# EasyEDA Pro project ProProject_扫描隧道显微镜OpenSTM_2023-08-25.epro, schematic ControlBoard

## Sheets
1 P1: Create Date: 2022-03-07; Page Name: P1; Project Name: STM-New-Structure; Schematic Name: ControlBoard; Update Date: 2022-12-20; Add into BOM: yes; Convert to PCB: yes
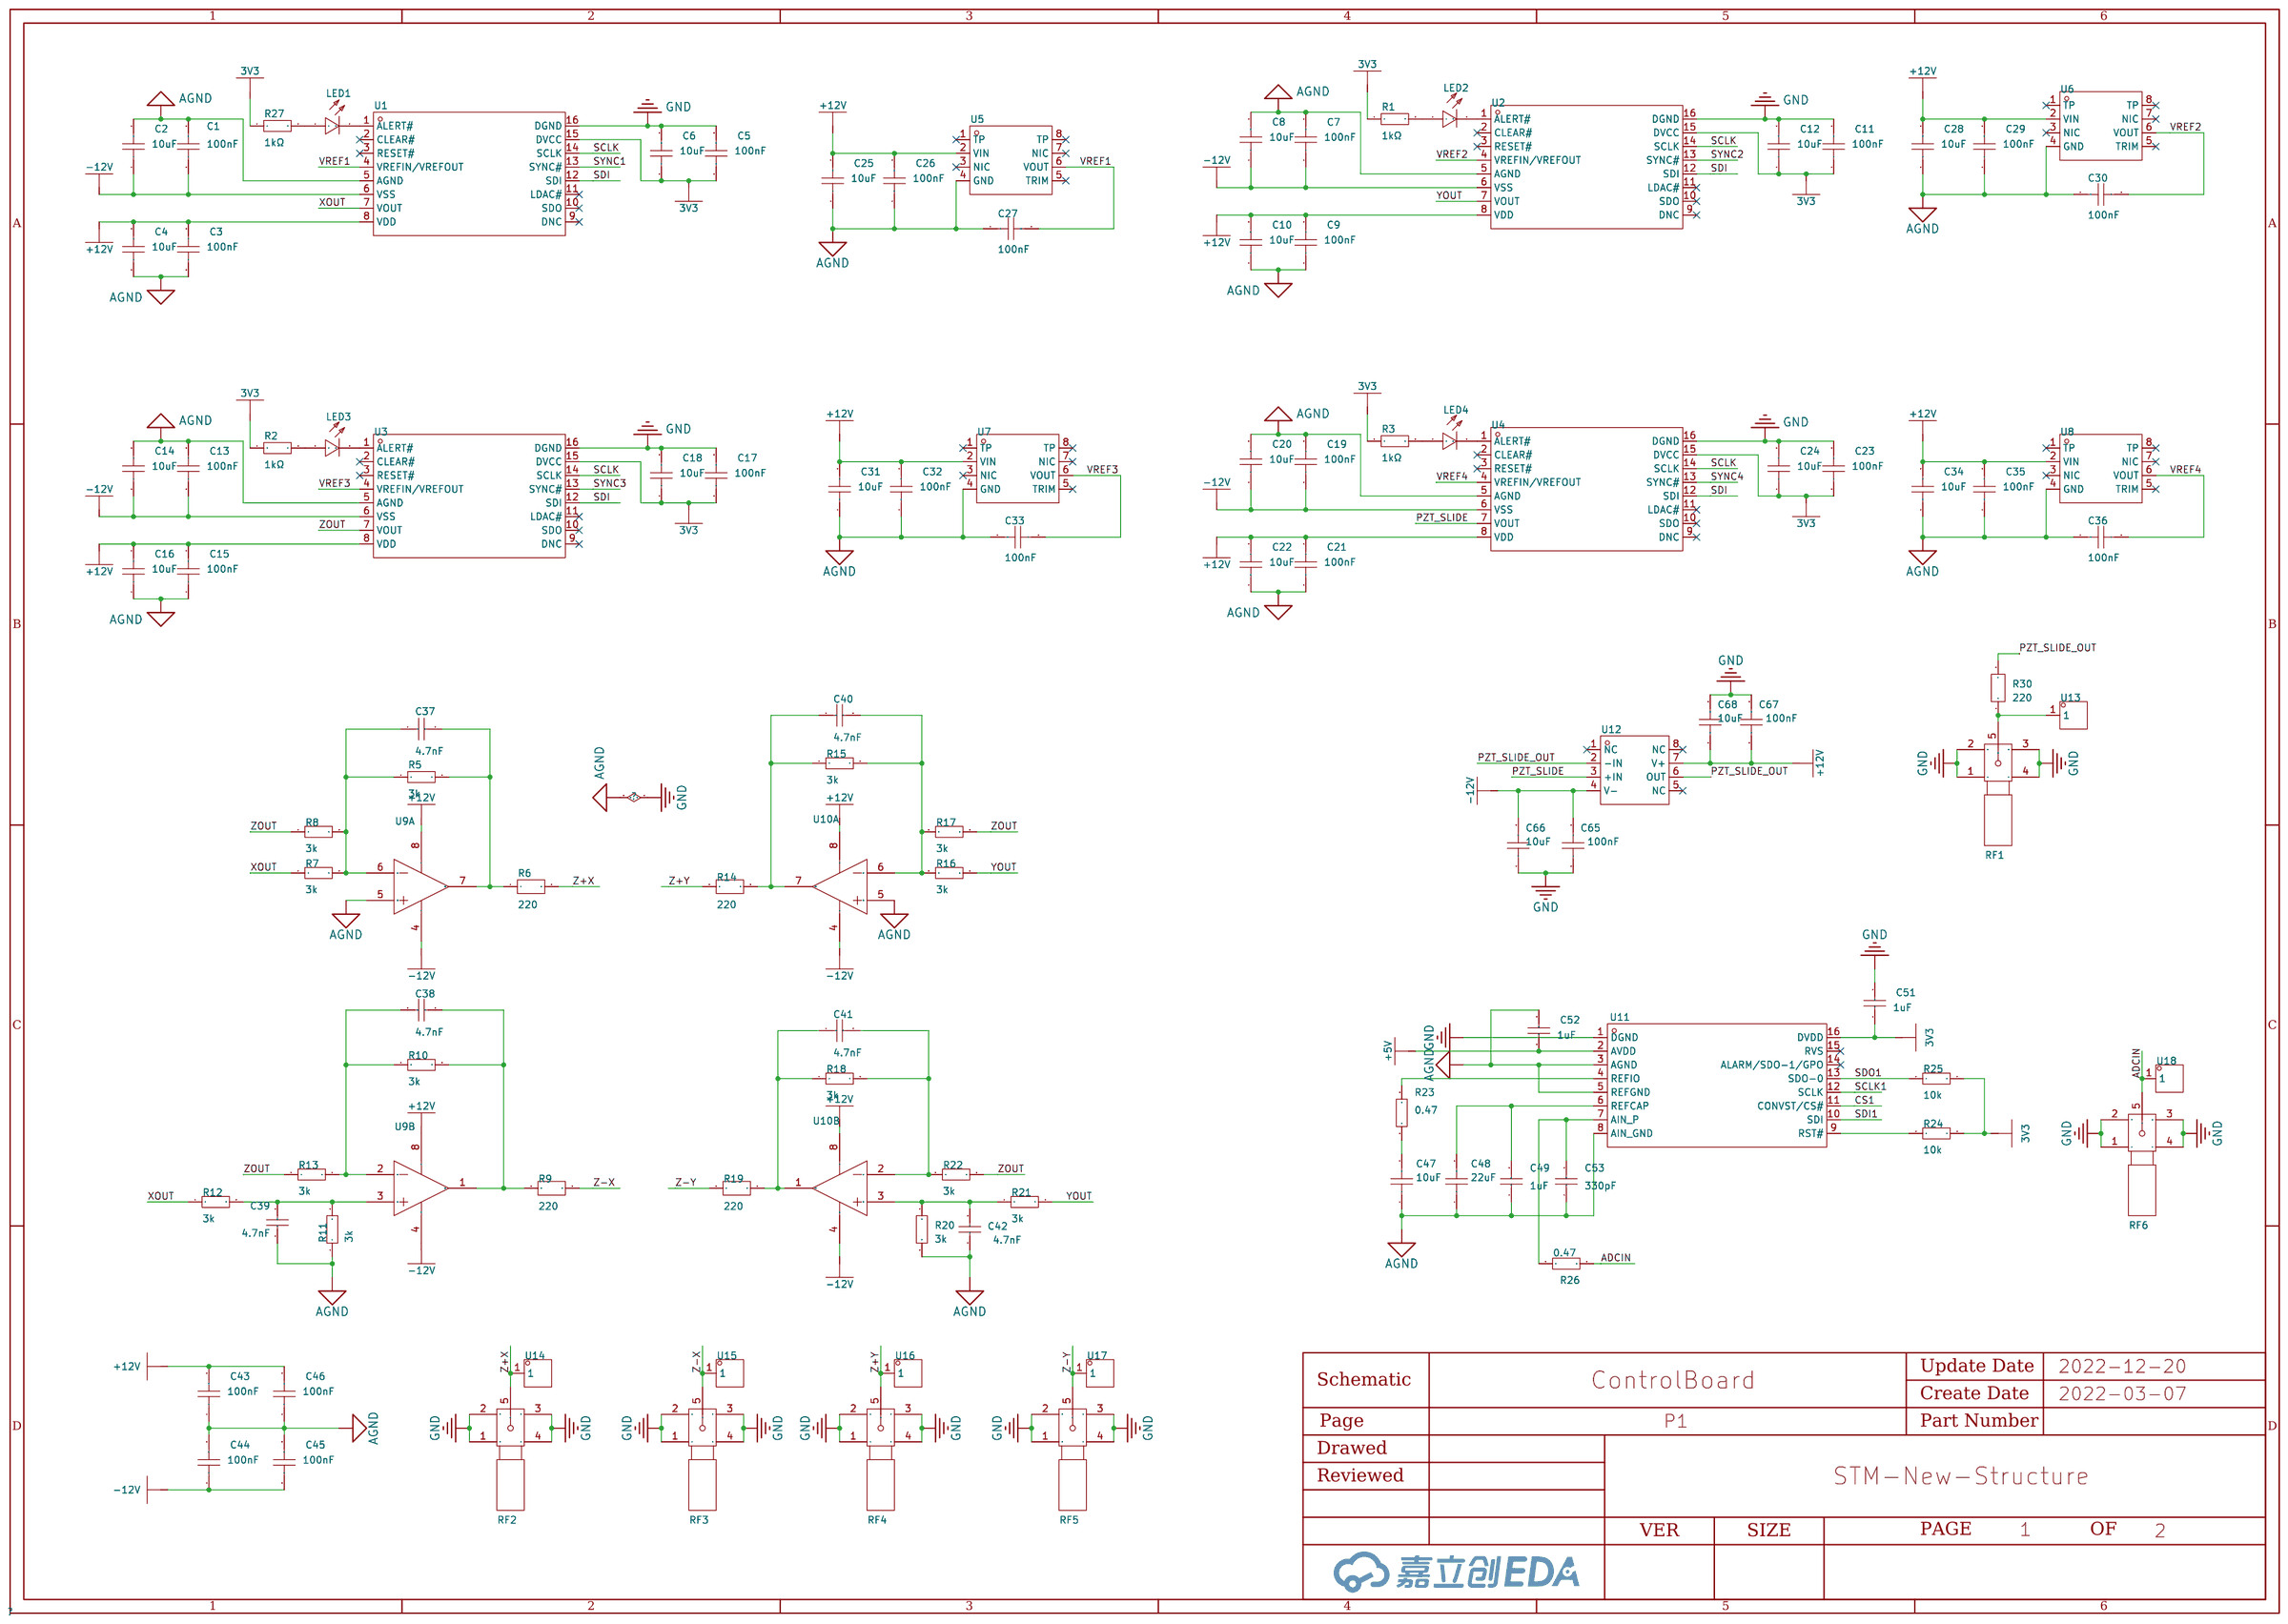
[diagram p0: P1]
2 P2: Create Date: 2022-03-08; Page Name: P2; Update Date: 2023-01-28
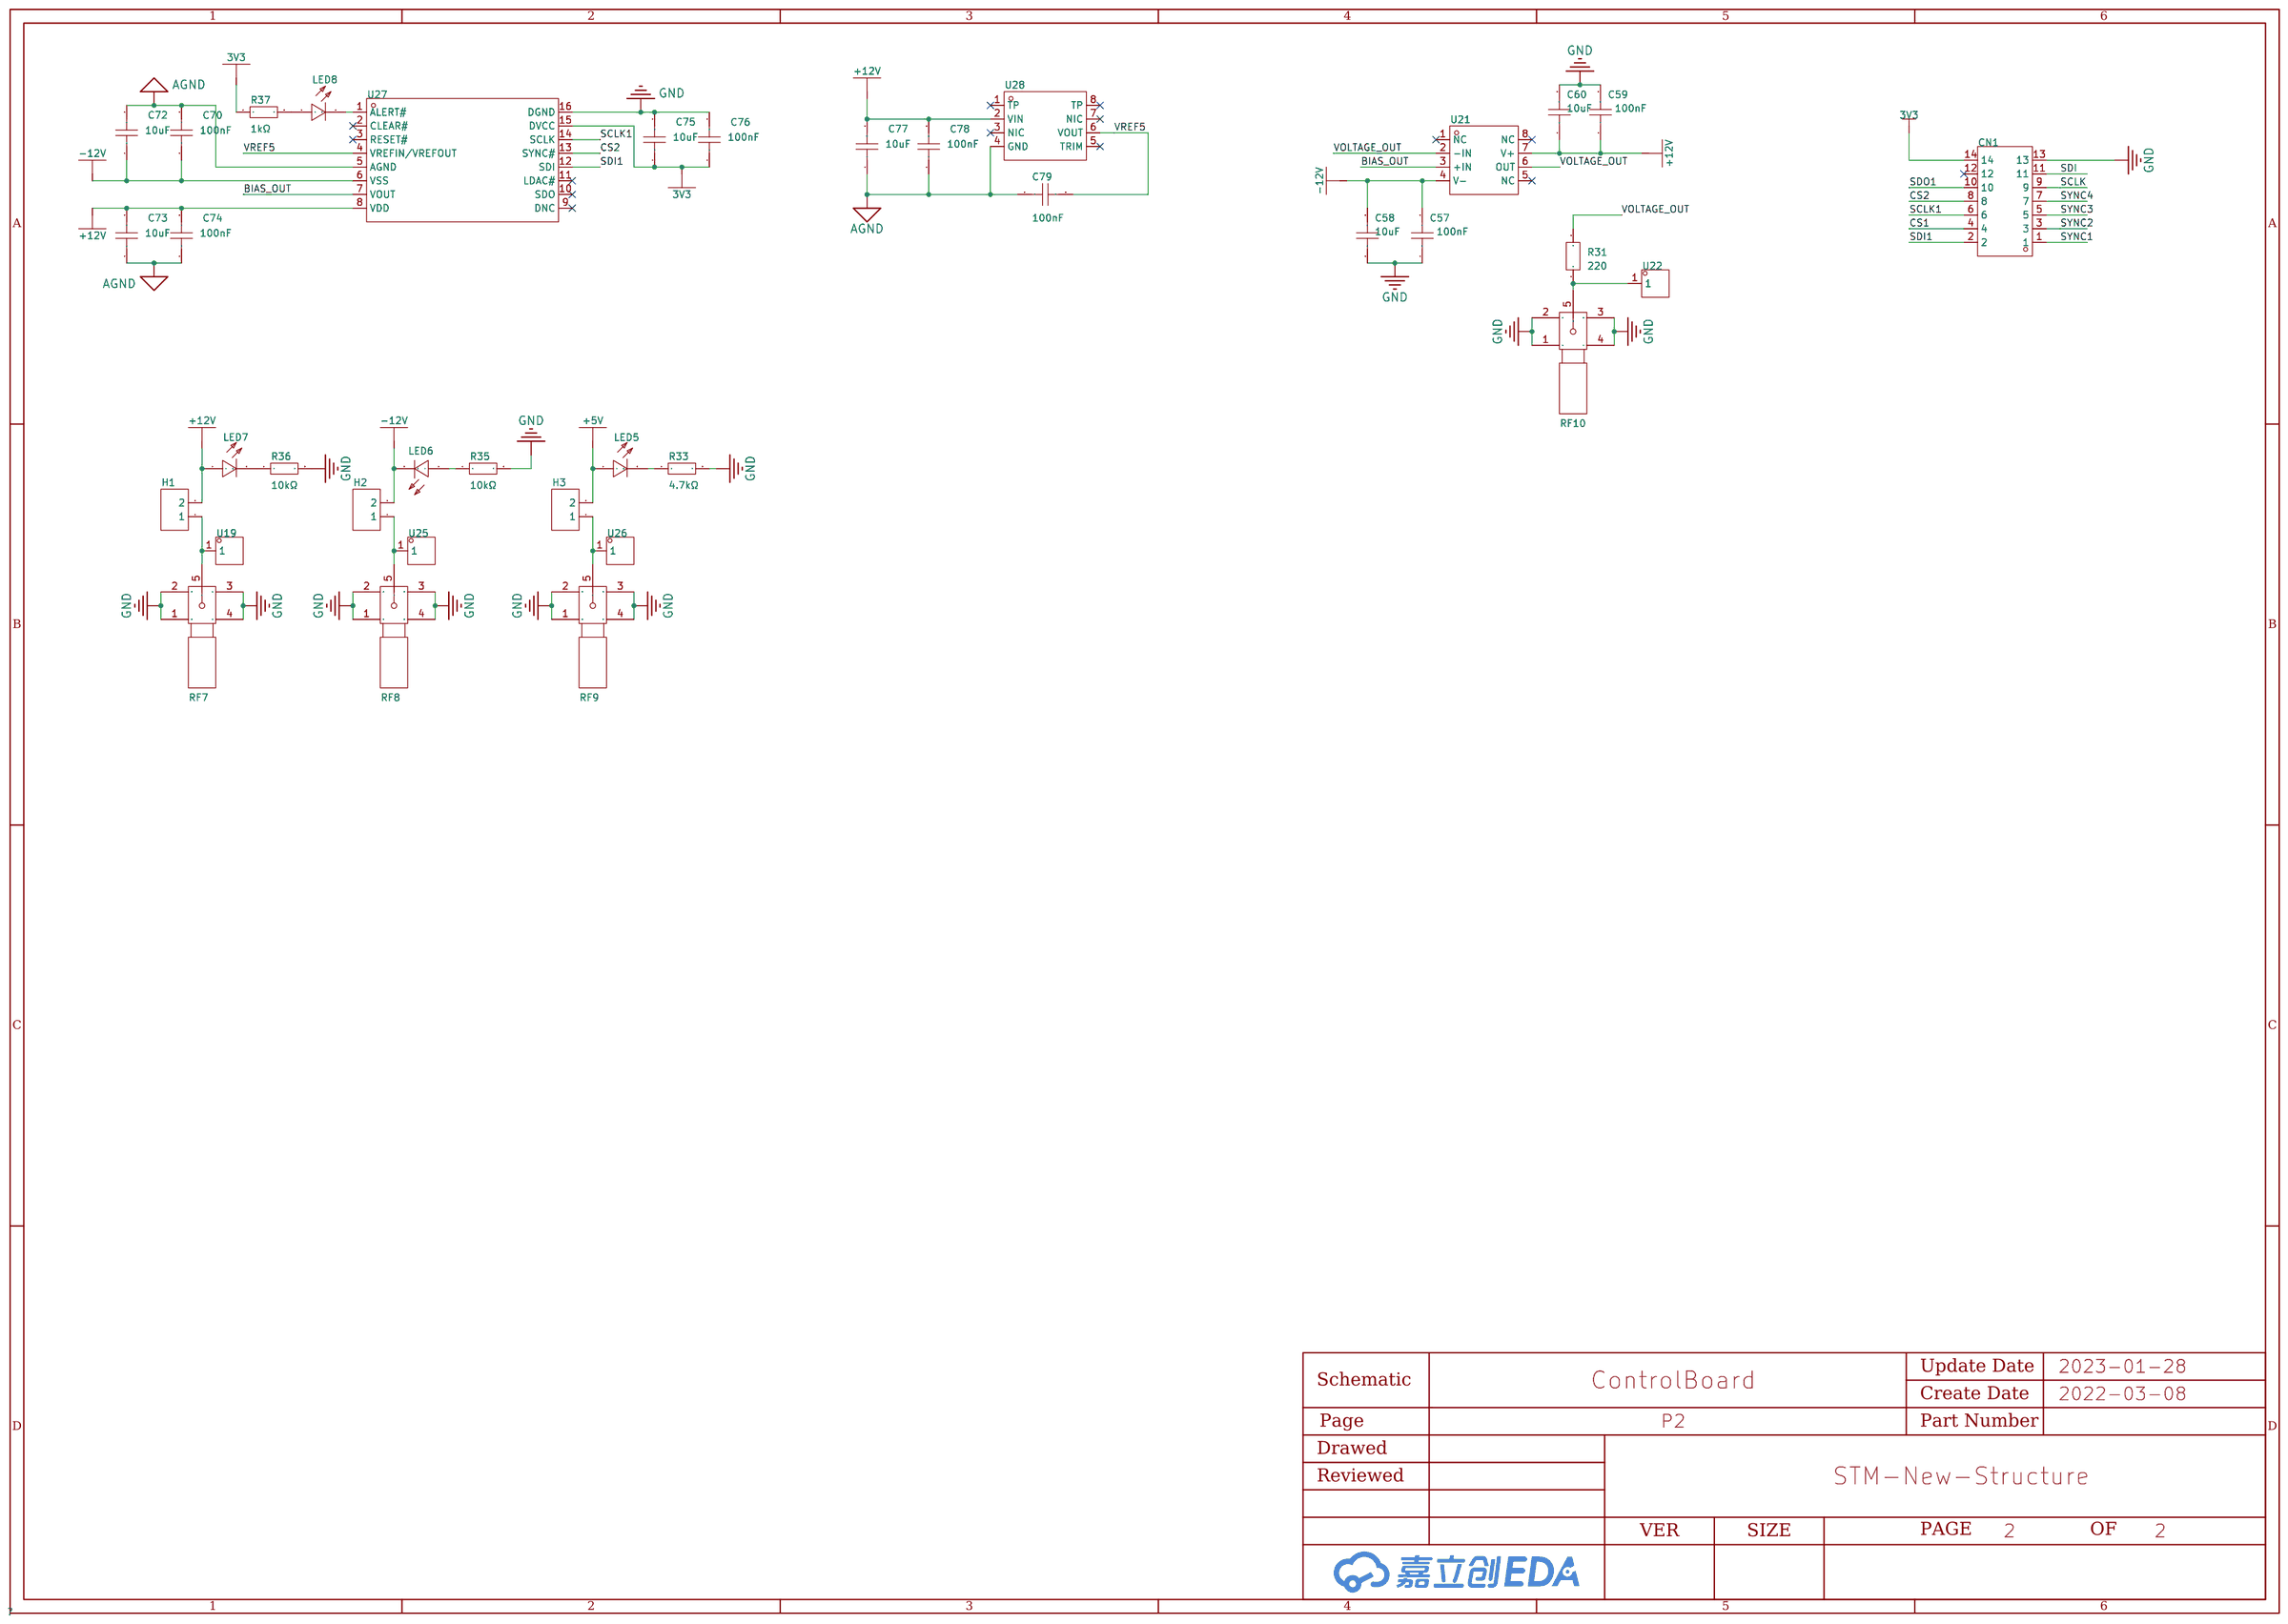
[diagram p1: P2]

## Parts
sheet P1
C1  100nF  [C0603]
C2  10uF  [C0603]
C3  100nF  [C0603]
C4  10uF  [C0603]
C5  100nF  [C0603]
C6  10uF  [C0603]
C7  100nF  [C0603]
C8  10uF  [C0603]
C9  100nF  [C0603]
C10  10uF  [C0603]
C11  100nF  [C0603]
C12  10uF  [C0603]
C13  100nF  [C0603]
C14  10uF  [C0603]
C15  100nF  [C0603]
C16  10uF  [C0603]
C17  100nF  [C0603]
C18  10uF  [C0603]
C19  100nF  [C0603]
C20  10uF  [C0603]
C21  100nF  [C0603]
C22  10uF  [C0603]
C23  100nF  [C0603]
C24  10uF  [C0603]
C25  10uF  [C0603]
C26  100nF  [C0603]
C27  100nF  [C0603]
C28  10uF  [C0603]
C29  100nF  [C0603]
C30  100nF  [C0603]
C31  10uF  [C0603]
C32  100nF  [C0603]
C33  100nF  [C0603]
C34  10uF  [C0603]
C35  100nF  [C0603]
C36  100nF  [C0603]
C37  4.7nF  [C0603]
C38  4.7nF  [C0603]
C39  4.7nF  [C0603]
C40  4.7nF  [C0603]
C41  4.7nF  [C0603]
C42  4.7nF  [C0603]
C43  100nF  [C0603]
C44  100nF  [C0603]
C45  100nF  [C0603]
C46  100nF  [C0603]
C47  10uF  [C0603]
C48  22uF  [C0603]
C49  1uF  [C0603]
C51  1uF  [C0603]
C52  1uF  [C0603]
C53  330pF  [C0603]
C65  100nF  [C0603]
C66  10uF  [C0603]
C67  100nF  [C0603]
C68  10uF  [C0603]
LED1  -  [LED0603-R-RD]
LED2  -  [LED0603-R-RD]
LED3  -  [LED0603-R-RD]
LED4  -  [LED0603-R-RD]
R1  1kΩ  [R0603]
R2  1kΩ  [R0603]
R3  1kΩ  [R0603]
R5  3k  [R0603]
R6  220  [R0603]
R7  3k  [R0603]
R8  3k  [R0603]
R9  220  [R0603]
R10  3k  [R0603]
R11  3k  [R0603]
R12  3k  [R0603]
R13  3k  [R0603]
R14  220  [R0603]
R15  3k  [R0603]
R16  3k  [R0603]
R17  3k  [R0603]
R18  3k  [R0603]
R19  220  [R0603]
R20  3k  [R0603]
R21  3k  [R0603]
R22  3k  [R0603]
R23  0.47  [R0603]
R24  10k  [R0603]
R25  10k  [R0603]
R26  0.47  [R0603]
R27  1kΩ  [R0603]
R30  220  [R0603]
RF1  -  [SMA-TH_KH-SMA-KE-Z]
RF2  -  [SMA-TH_KH-SMA-KE-Z]
RF3  -  [SMA-TH_KH-SMA-KE-Z]
RF4  -  [SMA-TH_KH-SMA-KE-Z]
RF5  -  [SMA-TH_KH-SMA-KE-Z]
RF6  -  [SMA-TH_KH-SMA-KE-Z]
U1  -  [TSSOP-16_L5.0-W4.4-P0.65-LS6.4-TL]
U2  -  [TSSOP-16_L5.0-W4.4-P0.65-LS6.4-TL]
U3  -  [TSSOP-16_L5.0-W4.4-P0.65-LS6.4-TL]
U4  -  [TSSOP-16_L5.0-W4.4-P0.65-LS6.4-TL]
U5  -  [SOIC-8_L4.9-W3.9-P1.27-LS6.0-BL]
U6  -  [SOIC-8_L4.9-W3.9-P1.27-LS6.0-BL]
U7  -  [SOIC-8_L4.9-W3.9-P1.27-LS6.0-BL]
U8  -  [SOIC-8_L4.9-W3.9-P1.27-LS6.0-BL]
U9  -  [SOIC-8_L4.9-W3.9-P1.27-LS6.0-BL]  (sections 1,2)
U10  -  [SOIC-8_L4.9-W3.9-P1.27-LS6.0-BL]  (sections 1,2)
U11  -  [TSSOP-16_L5.0-W4.4-P0.65-LS6.4-TL]
U12  -  [SOIC-8_L4.9-W3.9-P1.27-LS6.0-BL]
U13  -  [TEST-SMD_L2.7-W1.0]
U14  -  [TEST-SMD_L2.7-W1.0]
U15  -  [TEST-SMD_L2.7-W1.0]
U16  -  [TEST-SMD_L2.7-W1.0]
U17  -  [TEST-SMD_L2.7-W1.0]
U18  -  [TEST-SMD_L2.7-W1.0]
sheet P2
C57  100nF  [C0603]
C58  10uF  [C0603]
C59  100nF  [C0603]
C60  10uF  [C0603]
C70  100nF  [C0603]
C72  10uF  [C0603]
C73  10uF  [C0603]
C74  100nF  [C0603]
C75  10uF  [C0603]
C76  100nF  [C0603]
C77  10uF  [C0603]
C78  100nF  [C0603]
C79  100nF  [C0603]
CN1  X9555WR-2x07-6TV01  [CONN-TH_14P-P2.54_XKB_X9555WR-2X7-6TV01]
H1  -  [HDR-TH_2P-P2.54-V-F]
H2  -  [HDR-TH_2P-P2.54-V-F]
H3  -  [HDR-TH_2P-P2.54-V-F]
LED5  -  [LED0603-R-RD]
LED6  -  [LED0603-R-RD]
LED7  -  [LED0603-R-RD]
LED8  -  [LED0603-R-RD]
R31  220  [R0603]
R33  4.7kΩ  [R0603]
R35  10kΩ  [R0603]
R36  10kΩ  [R0603]
R37  1kΩ  [R0603]
RF7  -  [SMA-TH_KH-SMA-KE-Z]
RF8  -  [SMA-TH_KH-SMA-KE-Z]
RF9  -  [SMA-TH_KH-SMA-KE-Z]
RF10  -  [SMA-TH_KH-SMA-KE-Z]
U19  -  [TEST-SMD_L2.7-W1.0]
U21  AD8671ARZ-REEL7  [SOIC-8_L4.9-W3.9-P1.27-LS6.0-BL]
U22  -  [TEST-SMD_L2.7-W1.0]
U25  -  [TEST-SMD_L2.7-W1.0]
U26  -  [TEST-SMD_L2.7-W1.0]
U27  AD5721RBRUZ-RL7  [TSSOP-16_L5.0-W4.4-P0.65-LS6.4-BL]
U28  -  [SOIC-8_L4.9-W3.9-P1.27-LS6.0-BL]

## Library data of the parts
C1 C3 C5 C7 C9 C11 C13 C15 C17 C19 C21 C23 C26 C27 C29 C30 C32 C33 C35 C36 C43-C46 C57 C59 C65 C67 C70 C74 C76 C78 C79 = CL10B104KA8NNNC: 容值:100nF;精度:±10%;额定电压:25V;温度系数:X7R;; LCSC Part Name: 100nF ±10% 25V; Supplier Part: C1590; Manufacturer: SAMSUNG(三星); Supplier Footprint: 0603; JLCPCB Part Class: Extended Part; Datasheet: https://atta.szlcsc.com/upload/public/pdf/source/20160103/1457707680294.pdf; Supplier: LCSC; Tolerance: ±10%; Voltage Rated: 25V; Temperature Coefficient: X7R
C2 C4 C6 C8 C10 C12 C14 C16 C18 C20 C22 C24 C25 C28 C31 C34 C47 C58 C60 C66 C68 C72 C73 C75 C77 = GRM188R61E106MA73D: 容值:10uF;精度:±20%;额定电压:25V;温度系数:X5R;; LCSC Part Name: 10uF ±20% 25V; Supplier Part: C91606; Manufacturer: muRata(村田); Supplier Footprint: 0603; JLCPCB Part Class: Extended Part; Datasheet: https://atta.szlcsc.com/upload/public/pdf/source/20161226/1482720176185.pdf; Supplier: LCSC; Tolerance: ±20%; Voltage Rated: 25V; Temperature Coefficient: X5R
C37-C42 = 0603B472K500NT: 容值:4.7nF;精度:±10%;额定电压:50V;温度系数:X7R;; LCSC Part Name: 4.7nF ±10% 50V; Supplier Part: C53987; Manufacturer: FH(风华); Supplier Footprint: 0603; JLCPCB Part Class: Basic Part; Datasheet: https://atta.szlcsc.com/upload/public/pdf/source/20170923/C53987_1506149489951988835.pdf; Supplier: LCSC; Tolerance: ±10%; Voltage Rated: 50V; Temperature Coefficient: X7R
C48 = CL10A226MP8NUNE: 容值:22uF;精度:±20%;额定电压:10V;温度系数:X5R;; LCSC Part Name: 22uF ±20% 10V; Supplier Part: C86295; Manufacturer: SAMSUNG(三星); Supplier Footprint: 0603; JLCPCB Part Class: Extended Part; Datasheet: https://atta.szlcsc.com/upload/public/pdf/source/20170325/1490427882169.pdf; Supplier: LCSC; Tolerance: ±20%; Voltage Rated: 10V; Temperature Coefficient: X5R
C49 C51 C52 = CL10A105KA8NNNC: 容值:1uF;精度:±10%;额定电压:25V;温度系数:X5R;; LCSC Part Name: 1uF ±10% 25V; Supplier Part: C5673; Manufacturer: SAMSUNG(三星); Supplier Footprint: 0603; JLCPCB Part Class: Extended Part; Datasheet: https://atta.szlcsc.com/upload/public/pdf/source/20160103/1457707739994.pdf; Supplier: LCSC; Tolerance: ±10%; Voltage Rated: 25V; Temperature Coefficient: X5R
C53 = CL10C331JB8NNNC: 容值:330pF;精度:±5%;额定电压:50V;温度系数:C0G;; LCSC Part Name: 330pF ±5% 50V; Supplier Part: C1664; Manufacturer: SAMSUNG(三星); Supplier Footprint: 0603; JLCPCB Part Class: Basic Part; Datasheet: https://atta.szlcsc.com/upload/public/pdf/source/20160103/1457707688612.pdf; Supplier: LCSC; Tolerance: ±5%; Voltage Rated: 50V; Temperature Coefficient: C0G
LED1-LED8 = 19-217/R6C-AL1M2VY/3T: 发光颜色:红灯;二极管配置:-;透镜颜色:无色透明;主波长:617.5nm;峰值波长:632nm;色温:-;光通量(25时):-;测试电流:5mA;正向电压(VF):2.2V;发光强度:28.5mcd;功率:60mW;发光角度:120°;安装方式:-;工作温度:-40~+85;; LCSC Part Name: 0603 红灯; Supplier Part: C72044; Manufacturer: EVERLIGHT(台湾亿光); Supplier Footprint: 0603; JLCPCB Part Class: Extended Part; Datasheet: https://atta.szlcsc.com/upload/public/pdf/source/20160507/1462613613821.pdf; Supplier: LCSC; Emitted Color: 红灯; Lens Color: 无色透明; Dominant Wavelength: 617.5nm; Peak Wavelength: 632nm; Forward Current: 5mA; Forward Voltage (VF): 2.2V; Luminous Intensity: 28.5mcd; Power Dissipation: 60mW; Viewing Angle: 120°; Operating Temperature: -40~+85
R1-R3 R27 R37 = 0603WAF1001T5E: 电阻类型:厚膜电阻;阻值:1kΩ;精度:±1%;功率:100mW;温度系数:±100ppm/℃;最大工作电压:75V;工作温度范围:-55℃~+155℃;; LCSC Part Name: 1kΩ±1%100mW; Supplier Part: C21190; Manufacturer: UNI-ROYAL(厚声); Supplier Footprint: 0603; JLCPCB Part Class: BasicPart; Datasheet: https://atta.szlcsc.com/upload/public/pdf/source/20200306/C422600_1E6D84923E4A46A82E41ADD87F860B5C.pdf; Supplier: LCSC; Type: 厚膜电阻; Tolerance: ±1%; Power(Watts): 100mW; Temperature Coefficient: ±100ppm/℃; Overload Voltage (Max): 75V; Operating Temperature Range: -55℃~+155℃
R5 R7 R8 R10-R13 R15-R18 R20-R22 = ARG03DTC3001: 电阻类型:薄膜电阻;阻值:3k;精度:±0.5%;功率:100mW;温度系数:±25ppm/;最大工作电压:75V;工作温度范围:-55~+155;; LCSC Part Name: 3k ±0.5% 100mW; Supplier Part: C311916; Manufacturer: 光颉(Viking); Supplier Footprint: 0603; JLCPCB Part Class: Extended Part; Datasheet: https://atta.szlcsc.com/upload/public/pdf/source/20181119/C311916_083AB72433BF5B624DBE6C035DD51480.pdf; Supplier: LCSC; Type: 薄膜电阻; Tolerance: ±0.5%; Power(Watts): 100mW; Temperature Coefficient: ±25ppm/; Overload Voltage (Max): 75V; Operating Temperature Range: -55~+155
R6 R9 R14 R19 R30 R31 = ERJU3RD2200V: 阻值:220;精度:±0.5%;功率:100mW;温度系数:±50ppm/;最大工作电压:-;工作温度范围:-55~+155;; LCSC Part Name: 220 ±0.5% 100mW; Supplier Part: C491169; Manufacturer: PANASONIC(松下); Supplier Footprint: 0603; JLCPCB Part Class: Extended Part; Datasheet: https://atta.szlcsc.com/upload/public/pdf/source/20200407/C491169_AC2E94AF70820CF85EC0143B46F9F0DA.pdf; Supplier: LCSC; Tolerance: ±0.5%; Power(Watts): 100mW; Temperature Coefficient: ±50ppm/; Operating Temperature Range: -55~+155
R23 R26 = RL0603FR-070R47L: 阻值:0.47;精度:±1%;功率:100mW;温度系数:±800ppm/;; LCSC Part Name: 0.47 ±1% 100mW; Supplier Part: C326953; Manufacturer: YAGEO(国巨); Supplier Footprint: 0603; JLCPCB Part Class: Extended Part; Datasheet: https://atta.szlcsc.com/upload/public/pdf/source/20181031/C326953_2A06D5EACD581F8EE6DB7FFE6C5B8872.pdf; Supplier: LCSC; Tolerance: ±1%; Power(Watts): 100mW; Temperature Coefficient: ±800ppm/
R24 R25 = 0603WAF1002T5E: 电阻类型:厚膜电阻;阻值:10k;精度:±1%;功率:1/10W;温度系数:±100ppm/;最大工作电压:75V;工作温度范围:-55~+155;; LCSC Part Name: 10k ±1%; Supplier Part: C25804; Manufacturer: UNI-ROYAL(厚声); Supplier Footprint: 0603; JLCPCB Part Class: Basic Part; Datasheet: https://atta.szlcsc.com/upload/public/pdf/source/20200306/C422600_1E6D84923E4A46A82E41ADD87F860B5C.pdf; Supplier: LCSC; Type: 厚膜电阻; Tolerance: ±1%; Power(Watts): 1/10W; Temperature Coefficient: ±100ppm/; Overload Voltage (Max): 75V; Operating Temperature Range: -55~+155
RF1-RF10 = KH-SMA-KE-Z: 连接器类型:板端;射频系列:SMA;接口类型:内孔;端口数量:1;阻抗:-;频率-最大值:-;样式:正脚;接口直径:6.2mm;接口长度/高度:8mm;工作温度范围:-;; LCSC Part Name: SMA内孔正脚镀金半牙H=8MM; Supplier Part: C504007; Manufacturer: kinghelm(金航标); Supplier Footprint: 插件; JLCPCB Part Class: ExtendedPart; Datasheet: https://atta.szlcsc.com/upload/public/pdf/source/20200330/C504007_C31FA59B5EDC95FA4ACB3324B1A20151.pdf; Supplier: LCSC; Connector Type: 板端; RF Series: SMA; Interface Type: 内孔; Number of Ports: 1; Style: 正脚; Interface Diameter: 6.2mm; Interface Length/Height: 8mm
U1-U4 = AD5761RBRUZ: D/A 位数:-;D/A通道数:-;输出类型:-;读写接口类型:-;; Supplier Part: C404015; Manufacturer: ADI(亚德诺)/LINEAR; Supplier Footprint: TSSOP-16; JLCPCB Part Class: Extended Part; Datasheet: https://atta.szlcsc.com/upload/public/pdf/source/20190722/C404015_21C88E48C88813C7B0010A18F7ED8816.pdf; Supplier: LCSC
U5-U8 U28 = ADR421BRZ-REEL: Supplier Part: C496503; Manufacturer: ADI(亚德诺)/LINEAR; Supplier Footprint: SOIC-8; JLCPCB Part Class: Extended Part; Datasheet: https://atta.szlcsc.com/upload/public/pdf/source/20200316/C496503_A1F080746FA87D9455D96FF2B5AA62EC.pdf; Supplier: LCSC
U9 U10 = OPA2227UA/2K5: 运放类型:General Purpose;放大器组数:2;增益带宽积（GBP）:8MHz;压摆率（SR）:2.3 V/us;电源电压:5V ~ 36V, ±2.5V ~ 18V;各通道供电电流:3.7mA;; Supplier Part: C19308; Manufacturer: TI(德州仪器); Supplier Footprint: SOIC-8_150mil; JLCPCB Part Class: Extended Part; Datasheet: https://atta.szlcsc.com/upload/public/pdf/source/20130925/1457706650838.pdf; Supplier: LCSC; Amplifier Type: General Purpose; Number of Circuits: 2; Gain Bandwidth Product（GBP）: 8MHz; Slew Rate（SR）: 2.3 V/us; Supply Voltage（Single）: 5V ~ 36V, ±2.5V ~ 18V; Iq per channel (Typ): 3.7mA
U11 = ADS8685IPWR: A/D 位数:-;采样率（sps）:-;输入数:-;输入类型:-;; Supplier Part: C2669941; Manufacturer: TI(德州仪器); Supplier Footprint: TSSOP-16; JLCPCB Part Class: Extended Part; Supplier: LCSC
U12 U21 = AD8671ARZ-REEL7: 运放类型:GeneralPurpose;放大器组数:1;增益带宽积（GBP）:10MHz;压摆率（SR）:4V/us;电源电压:10V~36V,±5V~18V;各通道供电电流:3mA;; Supplier Part: C56309; Manufacturer: ADI(亚德诺)/LINEAR; Supplier Footprint: SOIC-8_150mil; JLCPCB Part Class: ExtendedPart; Datasheet: https://atta.szlcsc.com/upload/public/pdf/source/20150821/1457707348731.pdf; Supplier: LCSC; Amplifier Type: GeneralPurpose; Number of Circuits: 1; Gain Bandwidth Product（GBP）: 10MHz; Slew Rate（SR）: 4V/us; Supply Voltage（Single）: 10V~36V,±5V~18V; Iq per channel (Typ): 3mA; Operating Temperature: -40°C~125°C
U13-U19 U22 U25 U26 = 5017: 连接器类型:测试点/测试环;颜色:-;; LCSC Part Name: 测试点/测试环; Supplier Part: C238130; Manufacturer: Keystone; JLCPCB Part Class: ExtendedPart; Datasheet: https://atta.szlcsc.com/upload/public/pdf/source/20180629/C238130_5A26801579F58754781F264880A43AC8.PDF; Supplier: LCSC; Connector Type: 测试点/测试环
CN1 = X9555WR-2x07-6TV01: 参考系列:-;间距:2.54mm;插针结构:2x7P;排数:2;每排PIN数:7;行距:2.54mm;公母:公型插针;安装方式:弯插;额定电流:3A;触头材质:黄铜;触头镀层:金;工作温度范围:-25℃~+85℃;焊接温度(最大值):260℃;; LCSC Part Name: 2.54mm2x7P弯插; Supplier Part: C2884505; Manufacturer: XKBConnectivity(中国星坤); Supplier Footprint: 弯插,P=2.54mm; JLCPCB Part Class: ExtendedPart; Datasheet: https://atta.szlcsc.com/upload/public/pdf/source/20211009/ED69AC5D0B165AFEE3838F4DF324EF6E.pdf; Supplier: LCSC; Pitch: 2.54mm; Pins Structure: 2x7P; Number of Rows: 2; Number of PINs Per Row: 7; Row Spacing: 2.54mm; Gender: 公型插针; Mounting Style: 弯插; Current Rating (Max): 3A; Contact Material: 黄铜; Contact Plating: 金; Operating Temperature Range: -25℃~+85℃; Welding Temperature (Max): 260℃
H1-H3 = HDR-F_2.54_1x2P: Supplier Part: C49661; Supplier Footprint: 插件
R33 = 0603WAF4701T5E: 电阻类型:厚膜电阻;阻值:4.7kΩ;精度:±1%;功率:100mW;温度系数:±100ppm/℃;最大工作电压:75V;工作温度范围:-55℃~+155℃;; LCSC Part Name: 4.7kΩ±1%100mW; Supplier Part: C23162; Manufacturer: UNI-ROYAL(厚声); Supplier Footprint: 0603; JLCPCB Part Class: BasicPart; Datasheet: https://atta.szlcsc.com/upload/public/pdf/source/20200306/C422600_1E6D84923E4A46A82E41ADD87F860B5C.pdf; Supplier: LCSC; Type: 厚膜电阻; Tolerance: ±1%; Power(Watts): 100mW; Temperature Coefficient: ±100ppm/℃; Overload Voltage (Max): 75V; Operating Temperature Range: -55℃~+155℃
R35 R36 = 0603WAF1002T5E: 电阻类型:厚膜电阻;阻值:10kΩ;精度:±1%;功率:100mW;温度系数:±100ppm/℃;最大工作电压:75V;工作温度范围:-55℃~+155℃;; LCSC Part Name: 10kΩ±1%100mW; Supplier Part: C25804; Manufacturer: UNI-ROYAL(厚声); Supplier Footprint: 0603; JLCPCB Part Class: BasicPart; Datasheet: https://atta.szlcsc.com/upload/public/pdf/source/20200306/C422600_1E6D84923E4A46A82E41ADD87F860B5C.pdf; Supplier: LCSC; Type: 厚膜电阻; Tolerance: ±1%; Power(Watts): 100mW; Temperature Coefficient: ±100ppm/℃; Overload Voltage (Max): 75V; Operating Temperature Range: -55℃~+155℃
U27 = AD5721RBRUZ-RL7: Supplier Part: C2679721; Manufacturer: ADI(亚德诺)/LINEAR(凌特); Supplier Footprint: TSSOP-16; JLCPCB Part Class: ExtendedPart; Datasheet: https://atta.szlcsc.com/upload/public/pdf/source/20210603/ECE7F6A4264BD924F9063B284D4D4E62.pdf; Supplier: LCSC

## Nets
3V3: C5.1 C6.1 C11.1 C12.1 C17.1 C18.1 C23.1 C24.1 C51.1 C75.1 C76.1 CN1.14 R1.1 R2.1 R3.1 R24.2 R25.2 R27.1 R37.1 U1.15(DVCC) U2.15(DVCC) U3.15(DVCC) U4.15(DVCC) U11.16(DVDD) U27.15(DVCC)
+5V: C52.1 H3.2 LED5.1(A) U11.2(AVDD)
+12V: C3.2 C4.2 C9.2 C10.2 C15.2 C16.2 C21.2 C22.2 C25.2 C26.2 C28.2 C29.2 C31.2 C32.2 C34.2 C35.2 C43.2 C46.2 C59.1 C60.1 C67.1 C68.1 C73.2 C74.2 C77.2 C78.2 H1.2 LED7.1(A) U1.8(VDD) U2.8(VDD) U3.8(VDD) U4.8(VDD) U5.2(VIN) U6.2(VIN) U7.2(VIN) U8.2(VIN) U9.8(V+) U10.8(V+) U12.7(V+) U21.7(V+) U27.8(VDD) U28.2(VIN)
-12V: C1.1 C2.1 C7.1 C8.1 C13.1 C14.1 C19.1 C20.1 C44.1 C45.1 C57.2 C58.2 C65.2 C66.2 C70.1 C72.1 H2.2 LED6.2(C) U1.6(VSS) U2.6(VSS) U3.6(VSS) U4.6(VSS) U9.4(V-) U10.4(V-) U12.4(V-) U21.4(V-) U27.6(VSS)
AGND: C1.2 C2.2 C3.1 C4.1 C5.2 C6.2 C7.2 C8.2 C9.1 C10.1 C11.2 C12.2 C13.2 C14.2 C15.1 C16.1 C17.2 C18.2 C19.2 C20.2 C21.1 C22.1 C23.2 C24.2 C25.1 C26.1 C27.1 C28.1 C29.1 C30.1 C31.1 C32.1 C33.1 C34.1 C35.1 C36.1 C39.1 C42.2 C43.1 C44.2 C45.2 C46.1 C47.1 C48.1 C49.1 C51.2 C52.2 C53.1 C57.1 C58.1 C59.2 C60.2 C65.1 C66.1 C67.2 C68.2 C70.2 C72.2 C73.1 C74.1 C75.2 C76.2 C77.1 C78.1 C79.1 CN1.13 R11.1 R20.2 R33.2 R35.2 R36.2 RF1.1 RF1.2 RF1.3 RF1.4 RF2.1 RF2.2 RF2.3 RF2.4 RF3.1 RF3.2 RF3.3 RF3.4 RF4.1 RF4.2 RF4.3 RF4.4 RF5.1 RF5.2 RF5.3 RF5.4 RF6.1 RF6.2 RF6.3 RF6.4 RF7.1 RF7.2 RF7.3 RF7.4 RF8.1 RF8.2 RF8.3 RF8.4 RF9.1 RF9.2 RF9.3 RF9.4 RF10.1 RF10.2 RF10.3 RF10.4 U1.5(AGND) U1.16(DGND) U2.5(AGND) U2.16(DGND) U3.5(AGND) U3.16(DGND) U4.5(AGND) U4.16(DGND) U5.4(GND) U6.4(GND) U7.4(GND) U8.4(GND) U9.5(IN B+) U10.5(IN B+) U11.1(DGND) U11.3(AGND) U11.5(REFGND) U11.8(AIN_GND) U27.5(AGND) U27.16(DGND) U28.4(GND)
ADCIN: R26.2 RF6.5 U18.1
BIAS_OUT: U21.3(+IN) U27.7(VOUT)
CS1: CN1.4 U11.11(CONVST/CS#)
CS2: CN1.8 U27.13(SYNC#)
PZT_SLIDE: U4.7(VOUT) U12.3(+IN)
PZT_SLIDE_OUT: R30.2 U12.2(-IN) U12.6(OUT)
SCLK: CN1.9 U1.14(SCLK) U2.14(SCLK) U3.14(SCLK) U4.14(SCLK)
SCLK1: CN1.6 U11.12(SCLK) U27.14(SCLK)
SDI: CN1.11 U1.12(SDI) U2.12(SDI) U3.12(SDI) U4.12(SDI)
SDI1: CN1.2 U11.10(SDI) U27.12(SDI)
SDO1: CN1.10 R25.1 U11.13(SDO-0)
SYNC1: CN1.1 U1.13(SYNC#)
SYNC2: CN1.3 U2.13(SYNC#)
SYNC3: CN1.5 U3.13(SYNC#)
SYNC4: CN1.7 U4.13(SYNC#)
VOLTAGE_OUT: R31.2 U21.2(-IN) U21.6(OUT)
VREF1: C27.2 U1.4(VREFIN/VREFOUT) U5.6(VOUT)
VREF2: C30.2 U2.4(VREFIN/VREFOUT) U6.6(VOUT)
VREF3: C33.2 U3.4(VREFIN/VREFOUT) U7.6(VOUT)
VREF4: C36.2 U4.4(VREFIN/VREFOUT) U8.6(VOUT)
VREF5: C79.2 U27.4(VREFIN/VREFOUT) U28.6(VOUT)
XOUT: R7.1 R12.1 U1.7(VOUT)
YOUT: R16.2 R21.2 U2.7(VOUT)
Z+X: R6.2 RF2.5 U14.1
Z+Y: R14.1 RF4.5 U16.1
Z-X: R9.2 RF3.5 U15.1
Z-Y: R19.1 RF5.5 U17.1
ZOUT: R8.1 R13.1 R17.2 R22.2 U3.7(VOUT)
$1N1334: LED1.2(C) U1.1(ALERT#)
$1N4521: LED2.2(C) U2.1(ALERT#)
$1N6398: LED4.2(C) U4.1(ALERT#)
$1N6412: LED3.2(C) U3.1(ALERT#)
$1N17278: C37.2 R5.2 R6.1 U9.7(OUT B)
$1N17904: C37.1 R5.1 R7.2 R8.2 U9.6(IN B-)
$1N19975: C38.2 R9.1 R10.2 U9.1(OUT A)
$1N22239: C39.2 R11.2 R12.2 U9.3(IN A+)
$1N23370: C38.1 R10.1 R13.2 U9.2(IN A-)
$1N27431: C40.1 R14.2 R15.1 U10.7(OUT B)
$1N27675: C40.2 R15.2 R16.1 R17.1 U10.6(IN B-)
$1N29433: C41.1 R18.1 R19.2 U10.1(OUT A)
$1N29693: C41.2 R18.2 R22.1 U10.2(IN A-)
$1N31851: C42.1 R20.1 R21.1 U10.3(IN A+)
$1N44864: C47.2 R23.1
$1N45543: R23.2 U11.4(REFIO)
$1N48445: C48.2 C49.2 U11.6(REFCAP)
$1N53852: C53.2 R26.1 U11.7(AIN_P)
$1N55555: R24.1 U11.9(RST#)
$1N86130: LED1.1(A) R27.2
$1N86342: LED2.1(A) R1.2
$1N86554: LED3.1(A) R2.2
$1N86766: LED4.1(A) R3.2
$1N98330: R30.1 RF1.5 U13.1
$2N11015: R31.1 RF10.5 U22.1
$2N16241: H1.1 RF7.5 U19.1
$2N16244: H2.1 RF8.5 U25.1
$2N16819: H3.1 RF9.5 U26.1
$2N23862: LED5.2(C) R33.1
$2N24958: LED6.1(A) R35.1
$2N25511: LED7.2(C) R36.1
$2N27101: LED8.2(C) U27.1(ALERT#)
$2N28835: LED8.1(A) R37.2

Not connected (* = marked no-connect by the designer): CN1 12*; U1 2(CLEAR#)* 3(RESET#)* 9(DNC)* 10(SDO)* 11(LDAC#)*; U2 2(CLEAR#)* 3(RESET#)* 9(DNC)* 10(SDO)* 11(LDAC#)*; U3 2(CLEAR#)* 3(RESET#)* 9(DNC)* 10(SDO)* 11(LDAC#)*; U4 2(CLEAR#)* 3(RESET#)* 9(DNC)* 10(SDO)* 11(LDAC#)*; U5 1(TP)* 3(NIC)* 5(TRIM)* 7(NIC)* 8(TP)*; U6 1(TP)* 3(NIC)* 5(TRIM)* 7(NIC)* 8(TP)*; U7 1(TP)* 3(NIC)* 5(TRIM)* 7(NIC)* 8(TP)*; U8 1(TP)* 3(NIC)* 5(TRIM)* 7(NIC)* 8(TP)*; U11 14(ALARM/SDO-1/GPO)* 15(RVS)*; U12 1(NC)* 5(NC)* 8(NC)*; U21 1(NC)* 5(NC)* 8(NC)*; U27 2(CLEAR#)* 3(RESET#)* 9(DNC)* 10(SDO)* 11(LDAC#)*; U28 1(TP)* 3(NIC)* 5(TRIM)* 7(NIC)* 8(TP)*
